# Altium schematic sheet 2.SIM.SchDoc: 2.SIM_Interface
size A4; DrawnBy: Mason; Revision: V002; SheetNumber: 2; SheetTotal: 2; Team: Gateway; ProjectName: WM-N400MSE_Starter_kit_V002
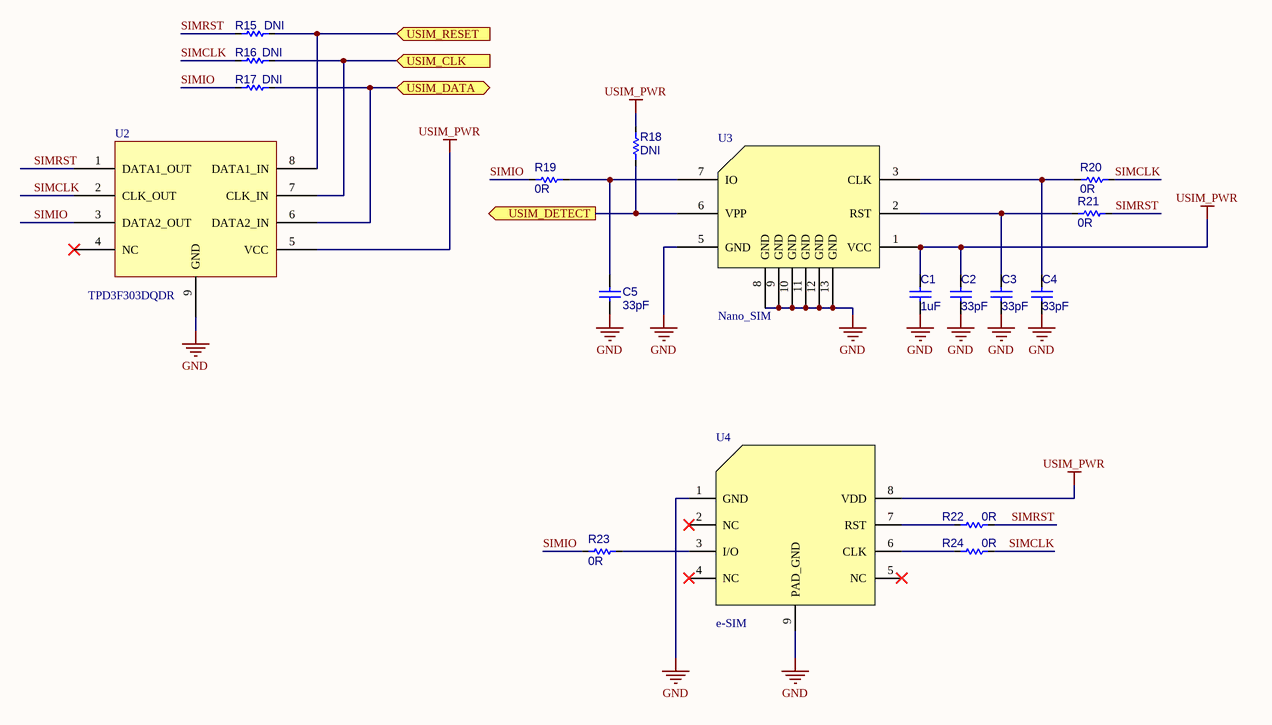
[diagram p0: 2.SIM.SchDoc]

## Parts
C1  1uF  [CAP-0402]
C2  33pF  [CAP-0402]
C3  33pF  [CAP-0402]
C4  33pF  [CAP-0402]
C5  33pF  [CAP-0402]
R15  DNI  [RES-0402]
R16  DNI  [RES-0402]
R17  DNI  [RES-0402]
R18  DNI  [RES-0402]
R19  0R  [RES-0402]
R20  0R  [RES-0402]
R21  0R  [RES-0402]
R22  0R  [RES-0402]
R23  0R  [RES-0402]
R24  0R  [RES-0402]
U2  TPD3F303DQDR  [PWSON08(0.4/1.45X1.8)]
U3  Nano_SIM  [693-043-020-611]
U4  e-SIM  [e-SIM]

## Ports
USIM_CLK (in), USIM_DATA (bidir), USIM_DETECT (out), USIM_RESET (in)

## Nets
GND: C1.1 C2.1 C3.1 C4.1 C5.1 U2.9(GND) U3.5(GND) U3.8(GND) U3.9(GND) U3.10(GND) U3.11(GND) U3.12(GND) U3.13(GND) U4.1(GND) U4.9(PAD_GND)
USIM_PWR: C1.2 C2.2 R18.1 U2.5(VCC) U3.1(VCC) U4.8(VDD)
SIMCLK: R16.2 R20.2 R24.2 U2.2(CLK_OUT)
SIMIO: R17.2 R19.1 R23.1 U2.3(DATA2_OUT)
SIMRST: R15.2 R21.2 R22.2 U2.1(DATA1_OUT)
USIM_CLK: R16.1 U2.7(CLK_IN) ; port USIM_CLK
USIM_DATA: R17.1 U2.6(DATA2_IN) ; port USIM_DATA
USIM_DETECT: R18.2 U3.6(VPP) ; port USIM_DETECT
USIM_RESET: R15.1 U2.8(DATA1_IN) ; port USIM_RESET
NetC3_2: C3.2 R21.1 U3.2(RST)
NetC4_2: C4.2 R20.1 U3.3(CLK)
NetC5_2: C5.2 R19.2 U3.7(IO)
NetR22_1: R22.1 U4.7(RST)
NetR23_2: R23.2 U4.3(I/O)
NetR24_1: R24.1 U4.6(CLK)

Not connected (* = marked no-connect by the designer): U2 4(NC)*; U4 2(NC)* 4(NC)* 5(NC)*

## Notes on the sheet
- Title
- Size:
- Date:
- A4
- Number:
- Revision:
- Sheet
- of
- WIZnet Co., Ltd.
- 5F, Humax Village
- Hwangseaul-ro, Bundang-gu
- Seongnam-si, Gyeongi-do
- South Korea
- Team:
- Drawn By:

## Library data of the parts
C1-C5 = CAP-0402: Ceramic CAP 0402(1005)
R15-R24 = RES-0402
U2 = TPD3F303DQDR: ESD Protection SIM
U3 = Nano_SIM: Nano SIM SMT 1.2mm Push/Pull